# Altium schematic sheet 1_P1.schdoc
size 309 x 223 mm
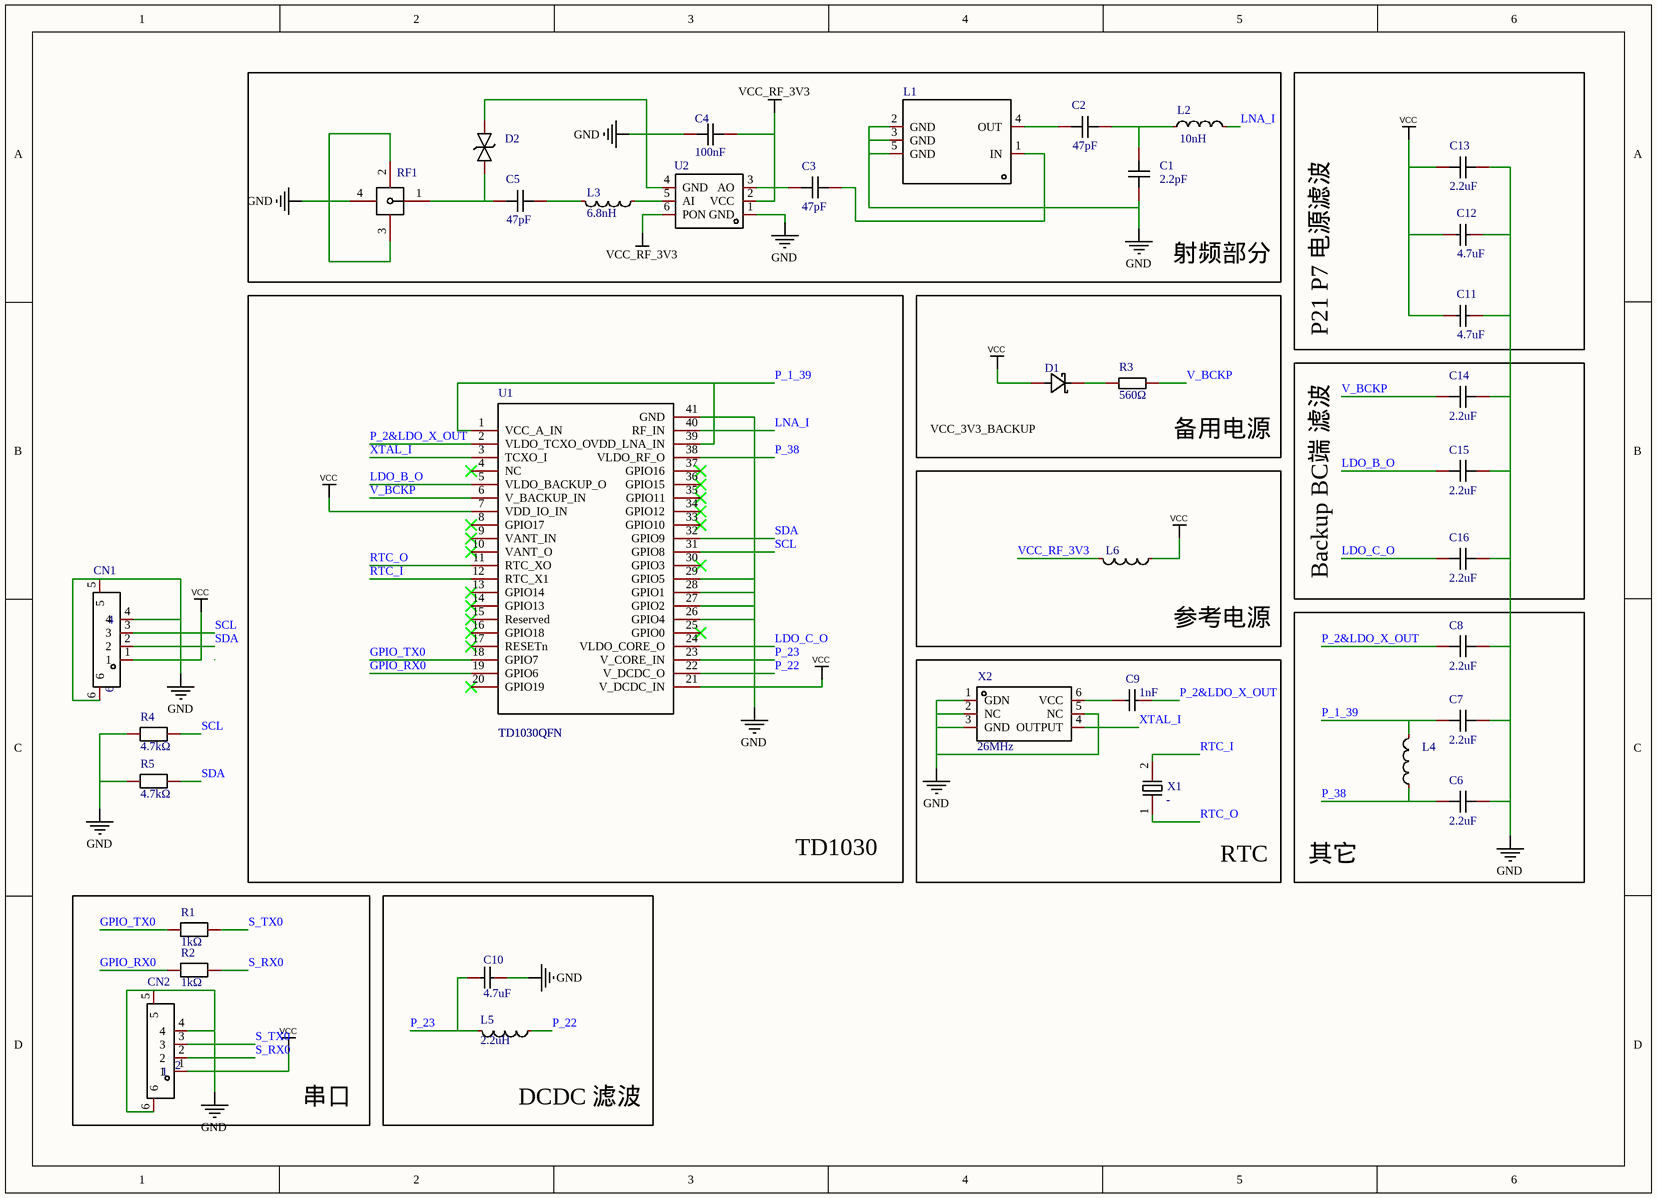
[diagram p0: 1_P1.schdoc]

## Parts
C1  value 2.2pF  [C0201]  (hidden comment: GRM0335C1H2R2CA01D)
C2  value 47pF  [C0201]  (hidden comment: GRM0335C1H470JA01D)
C3  value 47pF  [C0201]  (hidden comment: GRM0335C1H470JA01D)
C4  value 100nF  [C0201]  (hidden comment: CL03A104KQ3NNNC)
C5  value 47pF  [C0201]  (hidden comment: GRM0335C1H470JA01D)
C6  value 2.2uF  [C0402]  (hidden comment: CL05A225MQ5NNNC)
C7  value 2.2uF  [C0402]  (hidden comment: CL05A225MQ5NNNC)
C8  value 2.2uF  [C0402]  (hidden comment: CL05A225MQ5NNNC)
C9  value 1nF  [C0402]  (hidden comment: CL05B102KB5NNNC)
C10  value 4.7uF  [C0603]  (hidden comment: CL10A475KQ8NNNC)
C11  value 4.7uF  [C0603]  (hidden comment: CL10A475KQ8NNNC)
C12  value 4.7uF  [C0603]  (hidden comment: CL10A475KQ8NNNC)
C13  value 2.2uF  [C0402]  (hidden comment: CL05A225MQ5NNNC)
C14  value 2.2uF  [C0402]  (hidden comment: CL05A225MQ5NNNC)
C15  value 2.2uF  [C0402]  (hidden comment: CL05A225MQ5NNNC)
C16  value 2.2uF  [C0402]  (hidden comment: CL05A225MQ5NNNC)
CN1  NUMBER: 6  NAME: 4  [CONN-TH_4P-P0.20_XUNPU_WAFER-XH2.54-4PWB]  (hidden comment: WAFER-XH2.54-4PWB)
CN2  NUMBER: 2  NAME: 1  [CONN-TH_4P-P0.20_XUNPU_WAFER-XH2.54-4PWB]  (hidden comment: WAFER-XH2.54-4PWB)
D1  RB751S-40  [SOD-523_L1.2-W0.8-LS1.6-FD]  (value not drawn)
D2  ESD105-B1-02EL E6327  [TSLP-2-20_L1.0-W0.6-P0.65-BI]  (value not drawn)
L1  SAFEB1G57KE0F00R15  [FILTER-SMD_5P-L1.4-W1.1-L_HDF1588E-B2]  (value not drawn)
L2  value 10nH  [L0201]  (hidden comment: LQP03TG10NH02D)
L3  value 6.8nH  [L0201-RD]  (hidden comment: LQP03TN6N8H02D)
L4  BLM15AG601SN1D  [L0402]  (value not drawn)
L5  value 2.2uH  [L0603]  (hidden comment: LQM18PN2R2NC0L)
L6  BLM15AG601SN1D  [L0402]  (value not drawn)
R1  value 1kΩ  [R0402]  (hidden comment: CR0402J1K00Q10Z)
R2  value 1kΩ  [R0402]  (hidden comment: CR0402J1K00Q10Z)
R3  value 560Ω  [R0402]  (hidden comment: 0402WGJ0561TCE)
R4  value 4.7kΩ  [R0402]  (hidden comment: CRCW04024K70JNED)
R5  value 4.7kΩ  [R0402]  (hidden comment: CRCW04024K70JNED)
RF1  KH-IPEX3-2020  [IPEX-SMD_4P-L1.7-W1.7-LS2.0-L]  (value not drawn)
U1  TD1030QFN  [TD1030QFN40]
U2  BGA 824N6 E6327  [TSNP-6_L1.1-W0.7-P0.40-BL]  (value not drawn)
X1  NX3215SA-32.768K-STD-MUA-9  [OSC-SMD_L3.2-W1.5]  (value not drawn)
X2  value 26MHz  [SMD-2520_6P-L2.5-W2.0]  (hidden comment: TCO22260002805)

## Blocks framed on the sheet
射频部分: C1-C5 D2 L1-L3 RF1 U2
P21 P7 电源滤波: C11-C13
TD1030: U1
备用电源: D1 R3
Backup BC端 滤波: C14-C16
参考电源: L6
其它: C6-C8 L4
RTC: C9 X1 X2
串口: CN2 R1 R2
DCDC 滤波: C10 L5

## Nets
GND: C1.1 C4.1 C6.1 C7.1 C8.1 C10.2 C11.1 C12.1 C13.1 C14.1 C15.1 C16.1 CN1.4 CN1.5 CN1.6 CN2.4 CN2.5 CN2.6 D2.2 L1.2(GND) L1.3(GND) L1.5(GND) R4.1 R5.1 RF1.2 RF1.3 RF1.4 U1.26(GPIO4) U1.27(GPIO2) U1.28(GPIO1) U1.29(GPIO5) U1.41(GND) U2.1(GND) U2.4(GND) X2.1(GDN) X2.2(NC) X2.3(GND) X2.5(NC)
VCC: C11.2 C12.2 C13.2 CN1.1 CN2.1 D1.1(A) L6.1 U1.7(VDD_IO_IN) U1.21(V_DCDC_IN)
VCC_RF_3V3: L6.2 U2.6(PON)
GPIO_RX0: R2.1 U1.19(GPIO6)
GPIO_TX0: R1.1 U1.18(GPIO7)
LDO_B_O: C15.2 U1.5(VLDO_BACKUP_O)
LDO_C_O: C16.2 U1.24(VLDO_CORE_O)
LNA_I: L2.2 U1.40(RF_IN)
P_1_39: C7.2 L4.2 U1.1(VCC_A_IN) U1.39(VDD_LNA_IN)
P_2&LDO_X_OUT: C8.2 C9.2 U1.2(VLDO_TCXO_O)
P_22: L5.1 U1.22(V_DCDC_O)
P_23: C10.1 L5.2 U1.23(V_CORE_IN)
P_38: C6.2 L4.1 U1.38(VLDO_RF_O)
RTC_I: U1.12(RTC_X1) X1.2
RTC_O: U1.11(RTC_XO) X1.1
S_RX0: CN2.2 R2.2
S_TX0: CN2.3 R1.2
SCL: CN1.3 R4.2 U1.31(GPIO8)
SDA: CN1.2 R5.2 U1.32(GPIO9)
V_BCKP: C14.2 R3.2 U1.6(V_BACKUP_IN)
XTAL_I: U1.3(TCXO_I) X2.4(OUTPUT)
NetC1_2: C1.2 C2.2 L2.1
NetC2_1: C2.1 L1.4(OUT)
NetC3_1: C3.1 L1.1(IN)
NetC3_2: C3.2 U2.3(AO)
NetC4_2: C4.2 U2.2(VCC)
NetC5_1: C5.1 D2.1 RF1.1
NetC5_2: C5.2 L3.2
NetC9_1: C9.1 X2.6(VCC)
NetD1_2: D1.2(K) R3.1
NetL3_1: L3.1 U2.5(AI)

Not connected (* = marked no-connect by the designer): U1 4(NC)* 8(GPIO17)* 9(VANT_IN)* 10(VANT_O)* 13(GPIO14)* 14(GPIO13)* 15(Reserved)* 16(GPIO18)* 17(RESETn)* 20(GPIO19)* 25(GPIO0)* 30(GPIO3)* 33(GPIO10)* 34(GPIO12)* 35(GPIO11)* 36(GPIO15)* 37(GPIO16)*

## Notes on the sheet
- (near D1) VCC_3V3_BACKUP

## Library data of the parts
C1 = GRM0335C1H2R2CA01D: 容值:2.2pF;精度:±0.25pF;额定电压:50V;材质(温度系数):C0G;; Manufacturer: muRata(村田); Add into BOM: yes; Tolerance: ±0.25pF; Voltage Rated: 50V; Temperature Coefficient: C0G; Symbol: GRM0335C1H2R2CA01D; Device: GRM0335C1H2R2CA01D; LCSC Part Name: 2.2pF ±0.25pF 50V; Supplier Part: C85901; Manufacturer Part: GRM0335C1H2R2CA01D; Supplier Footprint: 0201; Datasheet: https://atta.szlcsc.com/upload/public/pdf/source/20180326/C85901_4B07D1A891032A6500FD33259A8D9F16.pdf; Supplier: LCSC; Convert to PCB: yes
C2 C3 C5 = GRM0335C1H470JA01D: 温度系数:C0G;精度:±5%;额定电压:50V;容值:47pF;; Manufacturer: muRata(村田); Add into BOM: yes; Temperature Coefficient: C0G; Tolerance: ±5%; Voltage Rated: 50V; Symbol: GRM0335C1H470JA01D; Device: GRM0335C1H470JA01D; LCSC Part Name: 47pF(470) ±5% 50V; Supplier Part: C85908; Manufacturer Part: GRM0335C1H470JA01D; Supplier Footprint: 0201; Datasheet: https://atta.szlcsc.com/upload/public/pdf/source/20180326/C85908_9E2E1A0386E64FE3BC8CC7D032B4DB3D.pdf; Supplier: LCSC; Convert to PCB: yes
C4 = CL03A104KQ3NNNC: 容值:100nF;精度:±10%;额定电压:6.3V;材质(温度系数):X5R;; Manufacturer: SAMSUNG(三星); Add into BOM: yes; Tolerance: ±10%; Voltage Rated: 6.3V; Temperature Coefficient: X5R; Symbol: CL03A104KQ3NNNC; Device: CL03A104KQ3NNNC; LCSC Part Name: 100nF ±10% 6.3V; Supplier Part: C160831; Manufacturer Part: CL03A104KQ3NNNC; Supplier Footprint: 0201; JLCPCB Part Class: Extended Part; Datasheet: https://atta.szlcsc.com/upload/public/pdf/source/20171228/C160831_15144412250661213800.pdf; Supplier: LCSC; Convert to PCB: yes
C6-C8 C13-C16 = CL05A225MQ5NNNC: 容值:2.2uF;精度:±20%;额定电压:6.3V;材质(温度系数):X5R;; Manufacturer: SAMSUNG(三星); Add into BOM: yes; Tolerance: ±20%; Voltage Rated: 6.3V; Temperature Coefficient: X5R; Symbol: CL05A225MQ5NNNC; Device: CL05A225MQ5NNNC; LCSC Part Name: 2.2uF ±20% 6.3V; Supplier Part: C107371; Manufacturer Part: CL05A225MQ5NNNC; Supplier Footprint: 0402; JLCPCB Part Class: Extended Part; Datasheet: https://atta.szlcsc.com/upload/public/pdf/source/20180125/C107371_15168614220061301441.pdf; Supplier: LCSC; Convert to PCB: yes
C9 = CL05B102KB5NNNC: 温度系数:X7R;容值:1nF;精度:±10%;额定电压:50V;; Manufacturer: SAMSUNG(三星); Add into BOM: yes; Temperature Coefficient: X7R; Tolerance: ±10%; Voltage Rated: 50V; Symbol: CL05B102KB5NNNC; Device: CL05B102KB5NNNC; LCSC Part Name: 1nF(102) ±10% 50V; Supplier Part: C14442; Manufacturer Part: CL05B102KB5NNNC; Supplier Footprint: 0402; JLCPCB Part Class: Extended Part; Datasheet: https://atta.szlcsc.com/upload/public/pdf/source/20160103/1457707670498.pdf; Supplier: LCSC; Convert to PCB: yes
C10-C12 = CL10A475KQ8NNNC: 容值:4.7uF;精度:±10%;额定电压:6.3V;材质(温度系数):X5R;; Manufacturer: SAMSUNG(三星); Add into BOM: yes; Tolerance: ±10%; Voltage Rated: 6.3V; Temperature Coefficient: X5R; Symbol: CL10A475KQ8NNNC; Device: CL10A475KQ8NNNC; LCSC Part Name: 4.7uF ±10% 6.3V; Supplier Part: C8032; Manufacturer Part: CL10A475KQ8NNNC; Supplier Footprint: 0603; JLCPCB Part Class: Extended Part; Datasheet: https://atta.szlcsc.com/upload/public/pdf/source/20160103/1457707744417.pdf; Supplier: LCSC; Convert to PCB: yes
CN1 = WAFER-XH2.54-4PWB: 间距:2.5mm;插针结构:1x4P;排数:1;每排PIN数:4;公母:公型插针;安装方式:卧贴;额定电流:3A;工作温度范围:-25~+85;; Manufacturer: XUNPU(讯普); Add into BOM: yes; Pitch: 2.5mm; Pins Structure: 1x4P; Gender: 公型插针; Current Rating (Max): 3A; Symbol: WAFER-XH2.54-4PWB; Device: WAFER-XH2.54-4PWB; LCSC Part Name: XH2.54mm 4P 卧贴; Supplier Part: C3029478; Manufacturer Part: WAFER-XH2.54-4PWB; Supplier Footprint: SMD,P=2.5mm; JLCPCB Part Class: Extended Part; Datasheet: https://atta.szlcsc.com/upload/public/pdf/source/20220527/7ACD2214A426F03D9ACD52F5A71E518C.pdf; Supplier: LCSC; Convert to PCB: yes; Number of Rows: 1; Number of PINs Per Row: 4; Mounting Style: 卧贴; Operating Temperature Range: -25~+85
CN2 = WAFER-XH2.54-4PWB: 间距:2.5mm;插针结构:1x4P;排数:1;每排PIN数:4;公母:公型插针;安装方式:卧贴;额定电流:3A;工作温度范围:-25~+85;; Manufacturer: XUNPU(讯普); Add into BOM: yes; Pitch: 2.5mm; Pins Structure: 1x4P; Number of PINs Per Row: 4; Gender: 公型插针; Current Rating (Max): 3A; Symbol: WAFER-XH2.54-4PWB; Device: WAFER-XH2.54-4PWB; LCSC Part Name: XH2.54mm 4P 卧贴; Supplier Part: C3029478; Manufacturer Part: WAFER-XH2.54-4PWB; Supplier Footprint: SMD,P=2.5mm; JLCPCB Part Class: Extended Part; Datasheet: https://atta.szlcsc.com/upload/public/pdf/source/20220527/7ACD2214A426F03D9ACD52F5A71E518C.pdf; Supplier: LCSC; Convert to PCB: yes; Number of Rows: 1; Mounting Style: 卧贴; Operating Temperature Range: -25~+85
D1 = RB751S-40: 二极管配置:-;直流反向耐压(Vr):30V;平均整流电流(Io):30mA;正向压降(Vf):370mV@1mA;反向电流(Ir):500nA@30V;; Manufacturer: ZRE(治润); Symbol: RB751S-40_C779694; Add into BOM: yes; Reverse Voltage (Vr): 30V; Average Rectified Current (Io): 30mA; Device: RB751S-40; LCSC Part Name: 30V 30mA 370mV@1mA; Supplier Part: C779694; Manufacturer Part: RB751S-40; Supplier Footprint: SOD-523; JLCPCB Part Class: Extended Part; Datasheet: https://atta.szlcsc.com/upload/public/pdf/source/20201109/C779694_A29C3BE3F0E680CC46A1138F8365F4C5.pdf; Supplier: LCSC; Convert to PCB: yes; Diode Configuration: -; Forward Voltage (Vf@If): 370mV@1mA; Reverse Leakage Current (Ir): 500nA@30V
D2 = ESD105-B1-02EL E6327: Manufacturer: Infineon(英飞凌); Add into BOM: yes; Symbol: ESD105-B1-02EL E6327; Device: ESD105-B1-02EL E6327; LCSC Part Name: ESD105-B1-02EL E6327; Supplier Part: C535148; Manufacturer Part: ESD105-B1-02EL E6327; Supplier Footprint: TSLP-2-20; JLCPCB Part Class: Extended Part; Datasheet: https://atta.szlcsc.com/upload/public/pdf/source/20200519/C535148_2A41CB8F1CEE6E84339B24B320877D1B.pdf; Supplier: LCSC; Convert to PCB: yes
L1 = SAFEB1G57KE0F00R15: 声表滤波器; Manufacturer: muRata(村田); Add into BOM: yes; Symbol: SAFEB1G57KE0F00R15; Device: SAFEB1G57KE0F00R15; LCSC Part Name: SAFEB1G57KE0F00R15; Supplier Part: C91645; Manufacturer Part: SAFEB1G57KE0F00R15; Supplier Footprint: SMD; JLCPCB Part Class: Extended Part; Datasheet: https://atta.szlcsc.com/upload/public/pdf/source/20170103/1483439943870.pdf; Supplier: LCSC; Convert to PCB: yes
L2 = LQP03TG10NH02D: 电感值:10nH;精度:±3%;额定电流:190mA;饱和电流(Isat):-;直流电阻(DCR):1.52Ω;; Manufacturer: muRata(村田); Add into BOM: yes; Tolerance: ±3%; Rated Current: 190mA; DC Resistance (DCR): 1.52Ω; Q @ Freq: 11@500MHz; Frequency - Self Resonant: 4.5GHz; Symbol: LQP03TG10NH02D; Device: LQP03TG10NH02D; LCSC Part Name: 10nH ±3% 190mA 1.52Ω; Supplier Part: C86095; Manufacturer Part: LQP03TG10NH02D; Supplier Footprint: 0201; Datasheet: https://atta.szlcsc.com/upload/public/pdf/source/20180327/C86095_A90744DB4CEF377AE7E439864B023996.pdf; Supplier: LCSC; Convert to PCB: yes; Saturation Current (Isat): -; Ratings: -
L3 = LQP03TN6N8H02D: 电感值:6.8nH;精度:±3%;额定电流:300mA;饱和电流(Isat):-;直流电阻(DCR):600mΩ;; Manufacturer: muRata(村田); Add into BOM: yes; Tolerance: ±3%; Rated Current: 300mA; DC Resistance (DCR): 600mΩ; Q @ Freq: 14@500MHz; Frequency - Self Resonant: 3.9GHz; Symbol: LQP03TN6N8H02D; Device: LQP03TN6N8H02D; LCSC Part Name: 6.8nH ±3% 300mA 600mΩ; Supplier Part: C162628; Manufacturer Part: LQP03TN6N8H02D; Supplier Footprint: 0201; JLCPCB Part Class: Extended Part; Datasheet: https://atta.szlcsc.com/upload/public/pdf/source/20180122/C162628_15166126570181291322.pdf; Supplier: LCSC; Convert to PCB: yes; Saturation Current (Isat): -; Ratings: -
L4 L6 = BLM15AG601SN1D: 标称阻抗@测试频率:600Ω@100MHz;误差:±25%;直流电阻(RDC):520mΩ;额定电流:300mA;电路数:1;; Manufacturer: muRata(村田); Add into BOM: yes; Tolerance: ±25%; DC Resistance: 520mΩ; Current Rating: 300mA; Circuits: 1; Symbol: BLM15AG601SN1D; Device: BLM15AG601SN1D; LCSC Part Name: 600Ω@100MHz ±25%; Supplier Part: C76884; Manufacturer Part: BLM15AG601SN1D; Supplier Footprint: 0402; JLCPCB Part Class: Extended Part; Datasheet: https://atta.szlcsc.com/upload/public/pdf/source/20180326/C76884_359C8A51D4D88607B1C7C4355A0568B0.pdf; Supplier: LCSC; Convert to PCB: yes; Impedance @ Frequency: 600Ω@100MHz
L5 = LQM18PN2R2NC0L: 额定电流:700mA;电感值:2.2uH;精度:±30%;直流电阻(DCR):300mΩ;; Manufacturer: muRata(村田); Add into BOM: yes; Rated Current: 700mA; Tolerance: ±30%; DC Resistance (DCR): 300mΩ; Symbol: LQM18PN2R2NC0L; Device: LQM18PN2R2NC0L; LCSC Part Name: 2.2uH ±30%; Supplier Part: C162580; Manufacturer Part: LQM18PN2R2NC0L; Supplier Footprint: 0603; JLCPCB Part Class: Extended Part; Datasheet: https://atta.szlcsc.com/upload/public/pdf/source/20180321/EF58C2AB9E5C2C24C03726A40AF3163C.pdf; Supplier: LCSC; Convert to PCB: yes
R1 R2 = CR0402J1K00Q10Z: 阻值:1kΩ;精度:±5%;功率:63mW;温度系数:±100ppm/;; Manufacturer: EVER OHMS(天二科技); Add into BOM: yes; Tolerance: ±5%; Power(Watts): 63mW; Symbol: CR0402J1K00Q10Z; Device: CR0402J1K00Q10Z; LCSC Part Name: 1kΩ ±5% 63mW; Supplier Part: C881213; Manufacturer Part: CR0402J1K00Q10Z; Supplier Footprint: 0402; JLCPCB Part Class: Extended Part; Datasheet: https://atta.szlcsc.com/upload/public/pdf/source/20201014/C881429_ABC29D63C8D6A11EB63D87348B25AA7B.pdf; Supplier: LCSC; Convert to PCB: yes; Temperature Coefficient: ±100ppm/
R3 = 0402WGJ0561TCE: 电阻类型:厚膜电阻;阻值:560Ω;精度:±5%;功率:1/16W;温度系数:±100ppm/;最大工作电压:50V;工作温度范围:-55~+155;; Manufacturer: UNI-ROYAL(厚声); Add into BOM: yes; Tolerance: ±5%; Power(Watts): 1/16W; Overload Voltage (Max): 50V; Symbol: 0402WGJ0561TCE; Device: 0402WGJ0561TCE; LCSC Part Name: 560Ω ±5%; Supplier Part: C25172; Manufacturer Part: 0402WGJ0561TCE; Supplier Footprint: 0402; JLCPCB Part Class: Extended Part; Datasheet: https://atta.szlcsc.com/upload/public/pdf/source/20200306/C422600_1E6D84923E4A46A82E41ADD87F860B5C.pdf; Supplier: LCSC; Convert to PCB: yes; Type: 厚膜电阻; Temperature Coefficient: ±100ppm/; Operating Temperature Range: -55~+155
R4 R5 = CRCW04024K70JNED: 电阻类型:-;阻值:4.7kΩ;精度:±5%;功率:63mW;温度系数:±200ppm/K;最大工作电压:75V;工作温度范围:-55~+155;; Manufacturer: VISHAY(威世); Add into BOM: yes; Tolerance: ±5%; Power(Watts): 63mW; Overload Voltage (Max): 75V; Symbol: CRCW04024K70JNED; Device: CRCW04024K70JNED; LCSC Part Name: 4.7kΩ ±5% 63mW; Supplier Part: C482283; Manufacturer Part: CRCW04024K70JNED; Supplier Footprint: 0402; JLCPCB Part Class: Extended Part; Datasheet: https://atta.szlcsc.com/upload/public/pdf/source/20200707/C482275_F3E4F76B68F979FDAD2F936CBE52FA57.pdf; Supplier: LCSC; Convert to PCB: yes; Type: -; Temperature Coefficient: ±200ppm/K; Operating Temperature Range: -55~+155
RF1 = KH-IPEX3-2020: 连接器类型:板端;射频系列:IPEX;接口类型:内针;端口数量:1;阻抗:-;频率-最大值:6GHz;样式:-;接口直径:1.4mm;接口长度/高度:-;工作温度范围:-;; Manufacturer: kinghelm(金航标); Add into BOM: yes; Connector Type: 板端; RF Series: IPEX; Interface Type: 内针; Number of Ports: 1; Frequency-Max: 6GHz; Interface Diameter: 1.4mm; Symbol: KH-IPEX3-2020; Device: KH-IPEX3-2020; LCSC Part Name: IPEX 内针 3代; Supplier Part: C530665; Manufacturer Part: KH-IPEX3-2020; Supplier Footprint: SMD; JLCPCB Part Class: Extended Part; Datasheet: https://atta.szlcsc.com/upload/public/pdf/source/20200512/C530665_29B7A4CC7CCD71DBBB1700D7F2262BCB.pdf; Supplier: LCSC; Convert to PCB: yes; Impedance: -; Style: -; Interface Length/Height: -; Operating Temperature Range: -
U1 = TD1030QFN: Convert to PCB: yes; Symbol: TD1030QFN; Device: TD1030QFN; Add into BOM: yes
U2 = BGA 824N6 E6327: 频率范围:-;IP1dB:-;增益:-;噪声系数:-;; Manufacturer: Infineon(英飞凌); Add into BOM: yes; Symbol: BGA 824N6 E6327; Device: BGA 824N6 E6327; LCSC Part Name: BGA 824N6 E6327; Supplier Part: C534176; Manufacturer Part: BGA 824N6 E6327; Supplier Footprint: TSNP-6; JLCPCB Part Class: Extended Part; Datasheet: https://atta.szlcsc.com/upload/public/pdf/source/20200515/C534176_ADD44C6ED1B319552BA0CA60DAF0D4A8.pdf; Supplier: LCSC; Convert to PCB: yes; Frequency Range: -; IP1dB: -; Gain: -; Noise Figure: -; RF Type: -; Voltage - Supply: -; Supply Current: -; Test Frequency: -
X1 = NX3215SA-32.768K-STD-MUA-9: 晶振类型:-;频率:-;频率公差:-;频率稳定度:-;负载电容:-;工作温度:-;; Manufacturer: NDK; Add into BOM: yes; Symbol: NX3215SA-32.768K-STD-MUA-9; Device: NX3215SA-32.768K-STD-MUA-9; LCSC Part Name: NX3215SA 32.768KHz 9.0pF ±20ppm -40~+85; Supplier Part: C519280; Manufacturer Part: NX3215SA-32.768K-STD-MUA-9; Supplier Footprint: SMD3215-2P; JLCPCB Part Class: Extended Part; Datasheet: https://atta.szlcsc.com/upload/public/pdf/source/20200427/C519280_14BACA32631F1F3A49A8251846C55372.pdf; Supplier: LCSC; Convert to PCB: yes; Crystal Type: -; Value: -; Frequency Tolerance: -; Frequency Stability: -; Load Capacitance: -; Operating Temperature: -
X2 = TCO22260002805: 频率:26MHz;频率稳定度:±0.5ppm;工作电压(最小值):1.8V;工作电压(典型值):-;工作电压(最大值):3.3V;供电电流:2mA;工作温度:-30~+85;; Manufacturer: JGHC(晶光华); Add into BOM: yes; Frequency Stability: ±0.5ppm; Supply Voltage (Min): 1.8V; Supply Voltage (Max): 3.3V; Supply Current (Max): 2mA; Symbol: TCO22260002805; Device: TCO22260002805; LCSC Part Name: 26MHz ±0.5ppm 2.8V; Supplier Part: C390806; Manufacturer Part: TCO22260002805; Supplier Footprint: SMD2520-6P; JLCPCB Part Class: Extended Part; Datasheet: https://atta.szlcsc.com/upload/public/pdf/source/20190806/C390806_896D855FC2E370C36DE32EFF59D2A386.pdf; Supplier: LCSC; Convert to PCB: yes; Supply Voltage (Typ): -; Operating Temperature: -30~+85